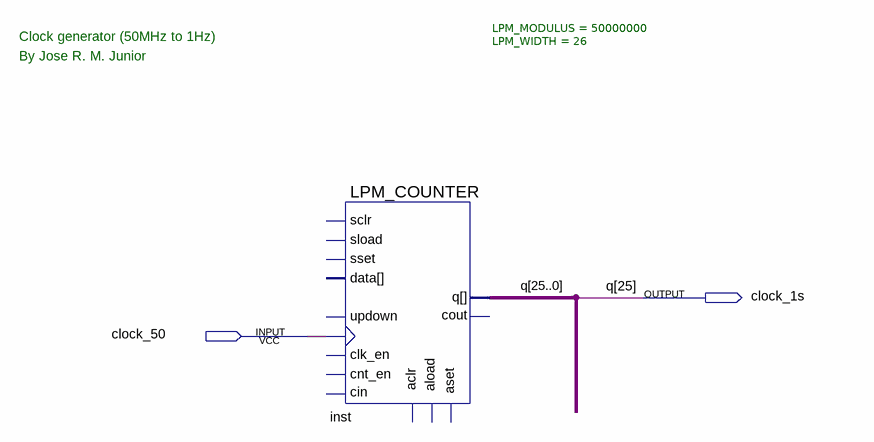
[diagram p0: schematic sheet]
// Quartus schematic clock_divider.bdf as structural Verilog: 1 symbols, 2 pins
module clock_divider (
  input  clock_50,
  output clock_1s
);

  wire [24:0] q;

  LPM_COUNTER #(.LPM_MODULUS(50000000), .LPM_WIDTH(26)) inst (
    .clock(clock_50), .q({clock_1s, q}));  // open: sload, data, clk_en, aload, aclr, aset, cin, sset, updown, cnt_en, sclr, cout

  // Other names for the same wires on the sheet: q[25] = clock_1s

  // Notes on the sheet:
  //   Clock generator (50MHz to 1Hz)
  //   By Jose R. M. Junior
endmodule
